# EAGLE schematic Optronik (EAGLE 7.5.0)

## Sheet 1 of 4: MCU_MAIN
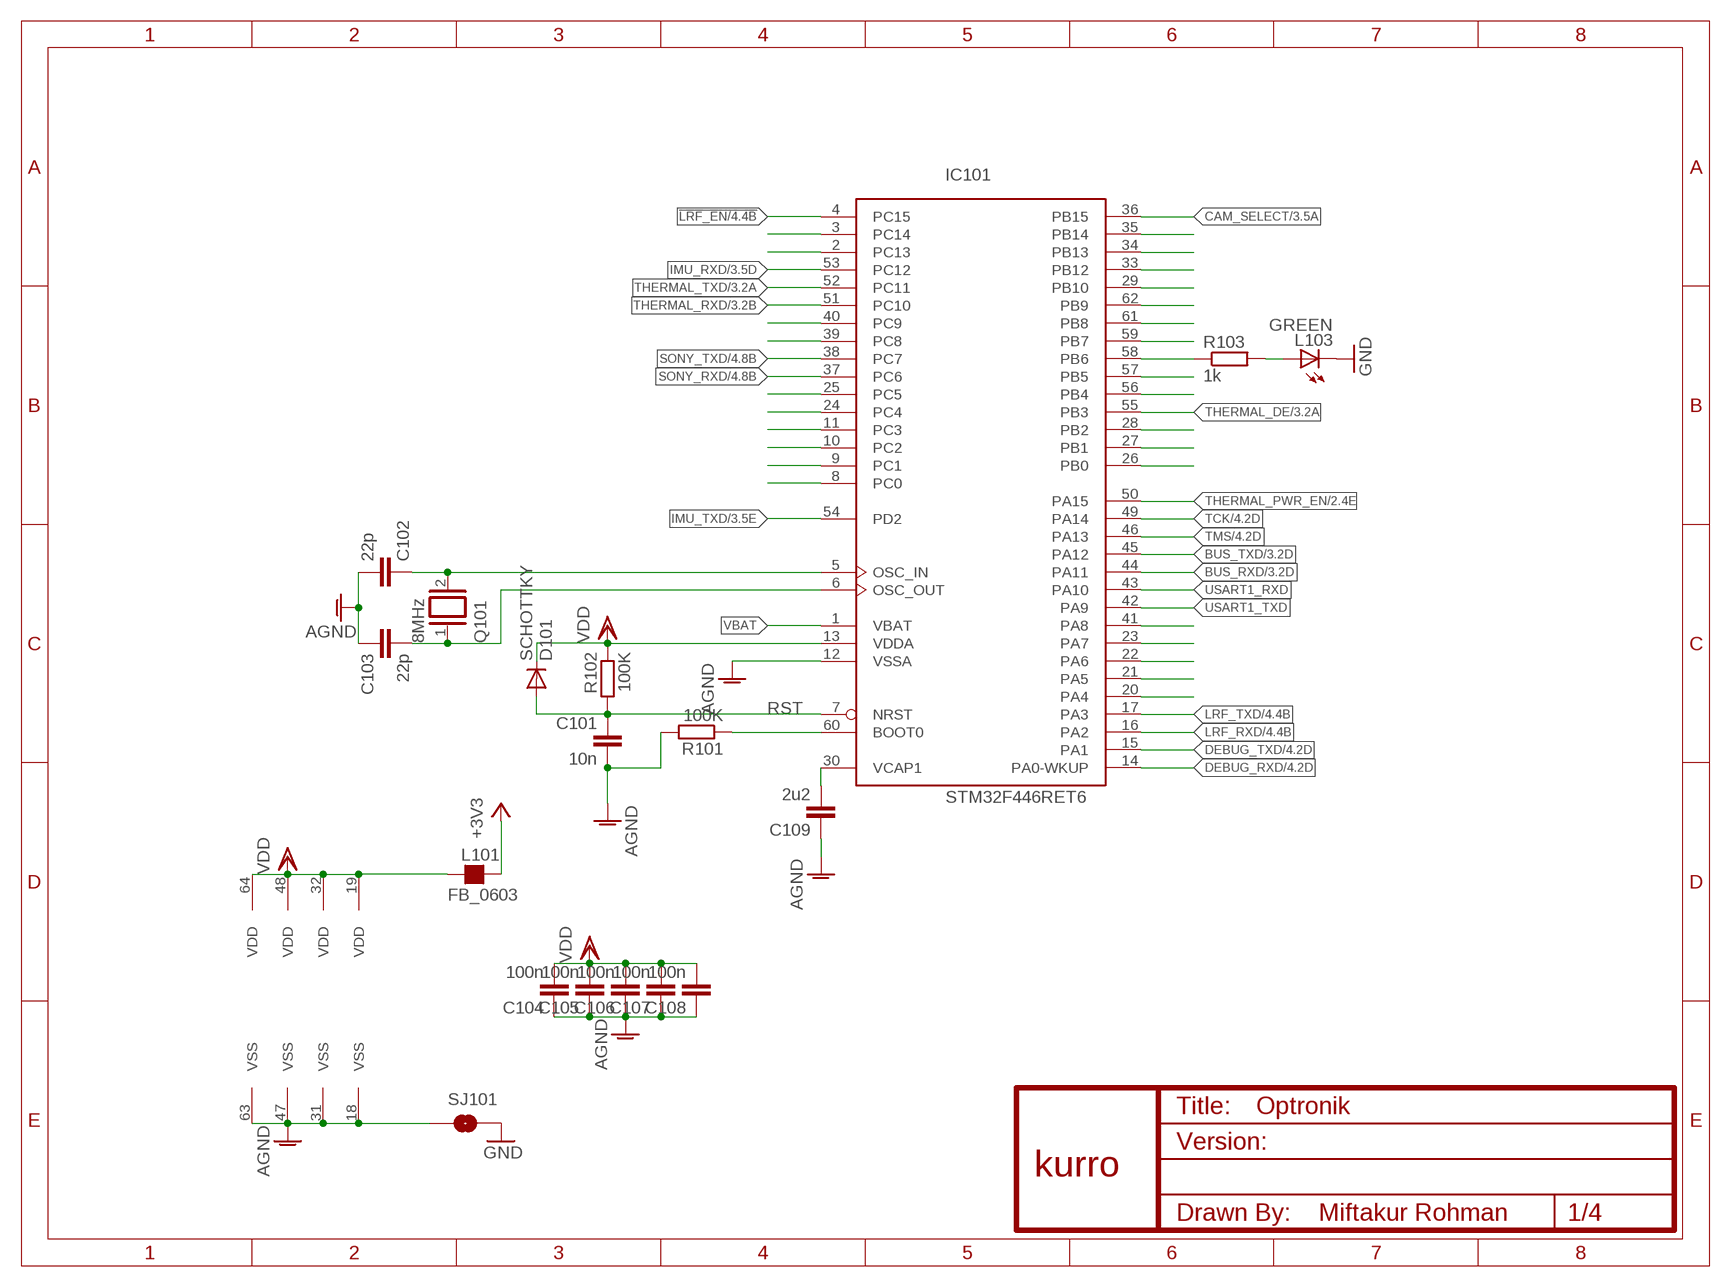
[diagram p0: schematic, sheet 1]

### Parts
C101  10n  C-EUC0603  [C0603]
C102  22p  C-EUC0603  [C0603]
C103  22p  C-EUC0603  [C0603]
C104  100n  C-EUC0603  [C0603]
C105  100n  C-EUC0603  [C0603]
C106  100n  C-EUC0603  [C0603]
C107  100n  C-EUC0603  [C0603]
C108  100n  C-EUC0603  [C0603]
C109  2u2  C-EUC0603  [C0603]
D101  SCHOTTKY  DIODE-MICROMELF-W  [MICROMELF-W]
IC101  STM32F446RET6  STM32F401RBT  [LQFP64]
L101  FB_0603  [L0603]
L103  GREEN  LEDCHIP-LED0805  [CHIP-LED0805]
Q101  8MHz  XTAL/S  [QS]
R101  100K  R-EU_R0603  [R0603]
R102  100K  R-EU_R0603  [R0603]
R103  1k  R-EU_R0603  [R0603]
SJ101  SOLDERJUMPERTRACE  [SJ_2S-TRACE]
U$1  KURRO_FOOTPRINT  [KURRO-LOGO]

### Nets
!LRF_EN [ic]: IC101.4(PC15) ; also sheet 4
+3V3: L101.2 ; also sheet 2,3,4
AGND [ic]: C101.2 C102.2 C103.1 C104.1 C105.1 C106.1 C107.1 C108.1 C109.1 IC101.12(VSSA) IC101.18(VSS) IC101.31(VSS) IC101.47(VSS) IC101.63(VSS) R101.2 SJ101.1
BOOT1 [ic]: IC101.60(BOOT0) R101.1
BUS_RXD [ic]: IC101.44(PA11) ; also sheet 3
BUS_TXD [ic]: IC101.45(PA12) ; also sheet 3
CAM_SELECT [ic]: IC101.36(PB15) ; also sheet 3
DEBUG_RXD [ic]: IC101.14(PA0-WKUP) ; also sheet 4
DEBUG_TXD [ic]: IC101.15(PA1) ; also sheet 4
GND: L103.C SJ101.2 ; also sheet 2,3,4
IMU_RXD [ic]: IC101.53(PC12) ; also sheet 3
IMU_TXD [ic]: IC101.54(PD2) ; also sheet 3
LED [ic]: IC101.58(PB6) R103.1
LRF_RXD [ic]: IC101.16(PA2) ; also sheet 4
LRF_TXD [ic]: IC101.17(PA3) ; also sheet 4
N$2 [ic]: C102.1 IC101.5(OSC_IN) Q101.2
N$4 [ic]: C109.2 IC101.30(VCAP1)
N$6 [ic]: IC101.22(PA6)
N$7 [ic]: IC101.3(PC14)
N$8 [ic]: IC101.2(PC13)
N$13 [ic]: IC101.40(PC9)
N$14 [ic]: IC101.39(PC8)
N$20 [ic]: IC101.41(PA8)
N$21 [ic]: IC101.62(PB9)
N$22 [ic]: L103.A R103.2
N$23 [ic]: IC101.21(PA5)
N$24 [ic]: C103.2 IC101.6(OSC_OUT) Q101.1
N$30 [ic]: IC101.23(PA7)
N$34 [ic]: IC101.20(PA4)
N$38 [ic]: IC101.26(PB0)
N$40 [ic]: IC101.27(PB1)
N$42 [ic]: IC101.28(PB2)
N$43 [ic]: IC101.29(PB10)
N$44 [ic]: IC101.33(PB12)
N$45 [ic]: IC101.34(PB13)
N$50 [ic]: IC101.25(PC5)
N$51 [ic]: IC101.35(PB14)
N$53 [ic]: IC101.24(PC4)
N$58 [ic]: IC101.11(PC3)
N$60 [ic]: IC101.10(PC2)
N$61 [ic]: IC101.9(PC1)
N$62 [ic]: IC101.8(PC0)
N$64 [ic]: IC101.61(PB8)
N$65 [ic]: IC101.59(PB7)
N$67 [ic]: IC101.57(PB5)
N$70 [ic]: IC101.56(PB4)
RST [ic]: C101.1 D101.A IC101.7(NRST) R102.2
SONY_RXD [ic]: IC101.37(PC6) ; also sheet 4
SONY_TXD [ic]: IC101.38(PC7) ; also sheet 4
TCK [ic]: IC101.49(PA14) ; also sheet 4
THERMAL_DE [ic]: IC101.55(PB3) ; also sheet 3
THERMAL_PWR_EN [ic]: IC101.50(PA15) ; also sheet 2
THERMAL_RXD [ic]: IC101.51(PC10) ; also sheet 3
THERMAL_TXD [ic]: IC101.52(PC11) ; also sheet 3
TMS [ic]: IC101.46(PA13) ; also sheet 4
USART1_RXD [ic]: IC101.43(PA10)
USART1_TXD [ic]: IC101.42(PA9)
VBAT [ic]: IC101.1(VBAT)
VDD [ic]: C104.2 C105.2 C106.2 C107.2 C108.2 D101.C IC101.13(VDDA) IC101.19(VDD) IC101.32(VDD) IC101.48(VDD) IC101.64(VDD) L101.1 R102.1 ; also sheet 4

## Sheet 2 of 4: PSU
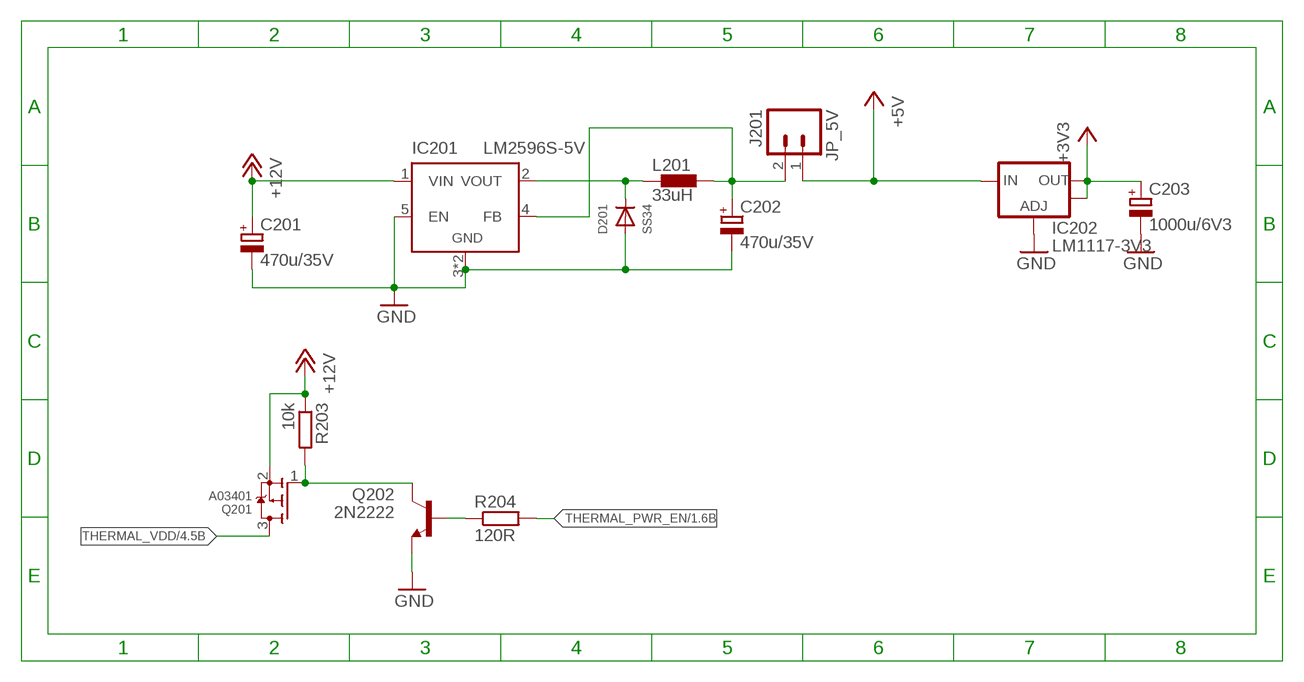
[diagram p1: schematic, sheet 2]

### Parts
C201  470u/35V  CPOL-EU153CLV-1012  [153CLV-1012]
C202  470u/35V  CPOL-EU153CLV-1012  [153CLV-1012]
C203  1000u/6V3  CPOL-EU153CLV-0810  [153CLV-0810]
D201  SS34  DIODESMA  [SMADIODE]
IC201  LM2596S-5V  LM2596S-ADJ  [D2PAK]
IC202  LM1117-3V3  V_REG_LM1117SOT223  [SOT223]
J201  JP_5V  M02-XH-VERT-SMD  [XH-2-VERT-SMD]
L201  33uH  PA4342  [PA4342]
Q201  A03401  A03401-WIDE  [SOT23-W]
Q202  2N2222  2N2222-REFLOW  [SOT23]
R203  10k  R-EU_R0603  [R0603]
R204  120R  R-EU_R0603  [R0603]

### Nets
+3V3: C203.+ IC202.2(OUT) IC202.4(OUT) ; also sheet 1,3,4
+5V: IC202.3(IN) J201.1 ; also sheet 3,4
+12V: C201.+ IC201.1(VIN) Q201.2(S) R203.1 ; also sheet 4
GND: C201.- C202.- C203.- D201.A IC201.3(GND) IC201.5(EN) IC201.6(GND) IC202.1(ADJ) Q202.2(E) ; also sheet 1,3,4
N$5: D201.C IC201.2(VOUT) L201.P$1
N$17: Q202.1(B) R204.1
N$29: C202.+ IC201.4(FB) J201.2 L201.P$2
N$39: Q201.1(G) Q202.3(C) R203.2
THERMAL_PWR_EN [ic]: R204.2 ; also sheet 1
THERMAL_VDD: Q201.3(D) ; also sheet 4

## Sheet 3 of 4
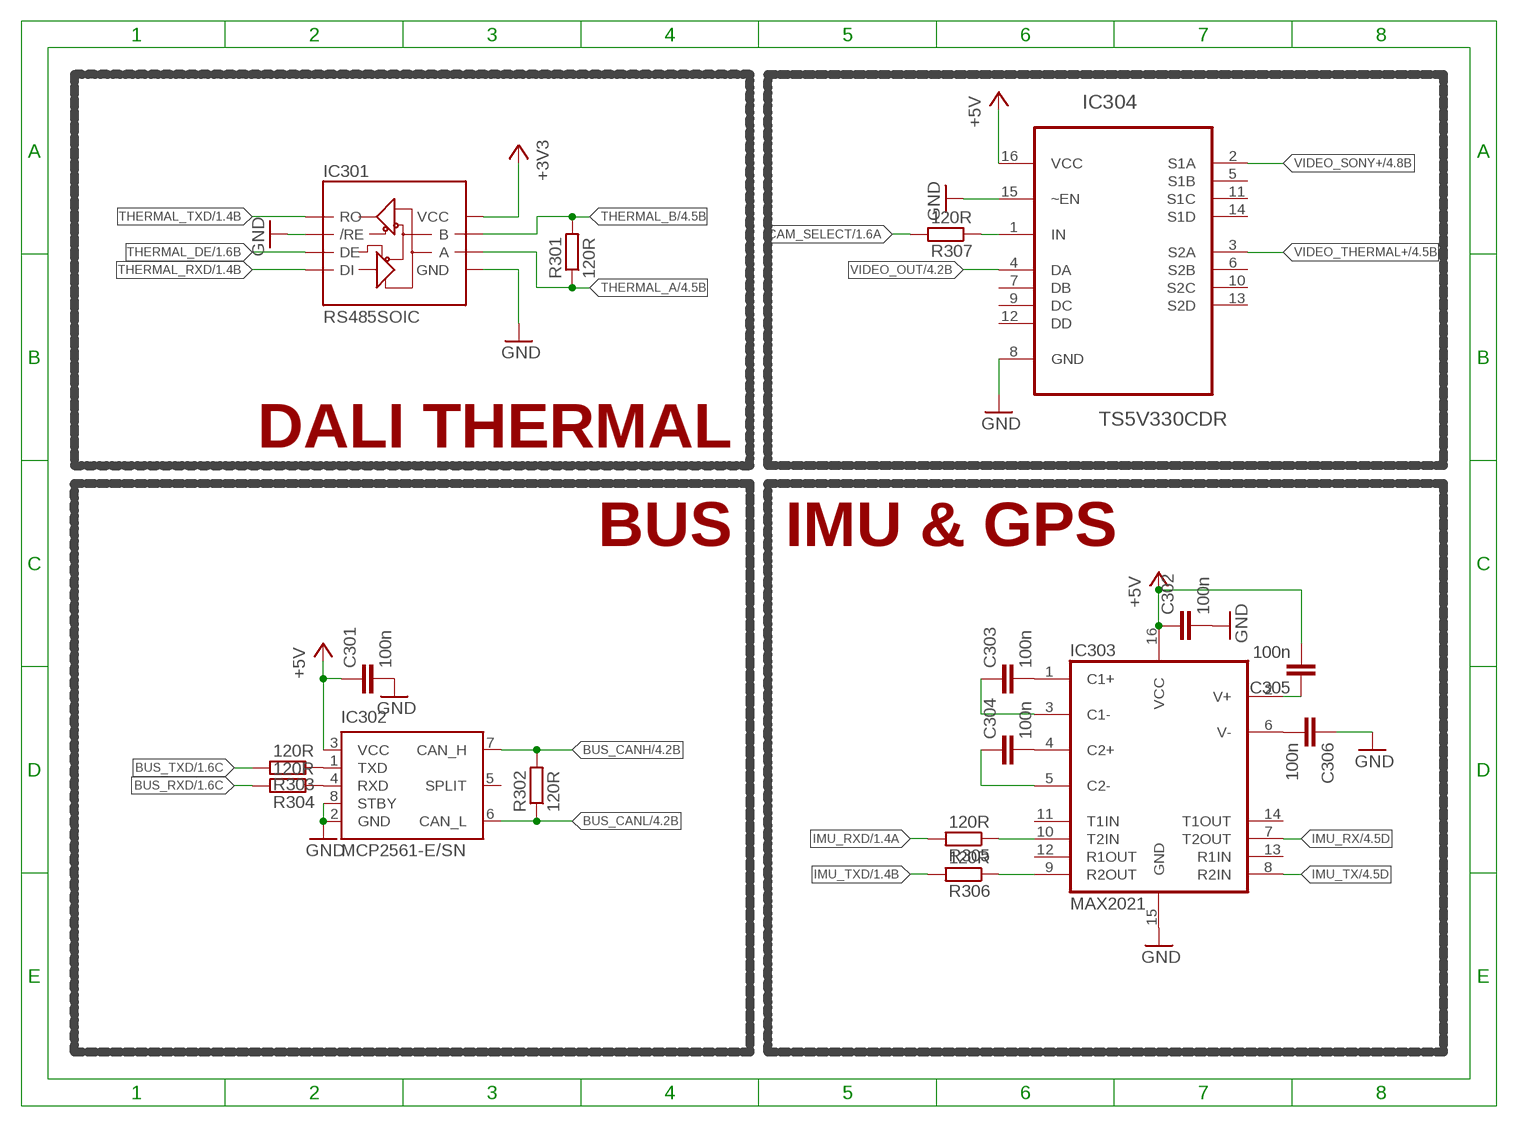
[diagram p2: schematic, sheet 3]

### Parts
C301  100n  C-EUC0603  [C0603]
C302  100n  C-EUC0603  [C0603]
C303  100n  C-EUC0603  [C0603]
C304  100n  C-EUC0603  [C0603]
C305  100n  C-EUC0603  [C0603]
C306  100n  C-EUC0603  [C0603]
IC301  RS485SOIC  [SO08]
IC302  MCP2561-E/SN  [SOIC-8]
IC303  MAX2021  MAX232SOIC16  [SO016]
IC304  TS5V330CDR  [SOIC127P600X175-16N]
R301  120R  R-EU_R0603  [R0603]
R302  120R  R-EU_R0603  [R0603]
R303  120R  R-EU_R0603  [R0603]
R304  120R  R-EU_R0603  [R0603]
R305  120R  R-EU_R0603  [R0603]
R306  120R  R-EU_R0603  [R0603]
R307  120R  R-EU_R0603  [R0603]

### Nets
+3V3: IC301.8(VCC) ; also sheet 1,2,4
+5V: C301.1 C302.1 C305.2 IC302.3(VCC) IC303.16(VCC) IC304.16(VCC) ; also sheet 2,4
BUS_CANH: IC302.7(CAN_H) R302.2 ; also sheet 4
BUS_CANL: IC302.6(CAN_L) R302.1 ; also sheet 4
BUS_RXD [ic]: R304.2 ; also sheet 1
BUS_TXD [ic]: R303.2 ; also sheet 1
CAM_SELECT [ic]: R307.2 ; also sheet 1
GND: C301.2 C302.2 C306.1 IC301.2(/RE) IC301.5(GND) IC302.2(GND) IC302.8(STBY) IC303.15(GND) IC304.8(GND) IC304.15(~EN) ; also sheet 1,2,4
IMU_RX: IC303.7(T2OUT) ; also sheet 4
IMU_RXD [ic]: R305.2 ; also sheet 1
IMU_TX: IC303.8(R2IN) ; also sheet 4
IMU_TXD [ic]: R306.2 ; also sheet 1
N$18: IC302.4(RXD) R304.1
N$31 [ic]: C306.2 IC303.6(V-)
N$32 [ic]: C303.2 IC303.1(C1+)
N$33 [ic]: C304.2 IC303.4(C2+)
N$49: IC302.1(TXD) R303.1
N$68: C303.1 IC303.3(C1-)
N$69: C304.1 IC303.5(C2-)
N$72: C305.1 IC303.2(V+)
N$73: IC304.1(IN) R307.1
N$74: IC303.10(T2IN) R305.1
N$75: IC303.9(R2OUT) R306.1
THERMAL_A: IC301.6(A) R301.1 ; also sheet 4
THERMAL_B: IC301.7(B) R301.2 ; also sheet 4
THERMAL_DE [ic]: IC301.3(DE) ; also sheet 1
THERMAL_RXD [ic]: IC301.4(DI) ; also sheet 1
THERMAL_TXD [ic]: IC301.1(RO) ; also sheet 1
VIDEO_OUT: IC304.4(DA) ; also sheet 4
VIDEO_SONY+: IC304.2(S1A) ; also sheet 4
VIDEO_THERMAL+: IC304.3(S2A) ; also sheet 4
Unconnected: IC302.5(SPLIT) IC303.11(T1IN) IC303.12(R1OUT) IC303.13(R1IN) IC303.14(T1OUT) IC304.5(S1B) IC304.6(S2B) IC304.7(DB) IC304.9(DC) IC304.10(S2C) IC304.11(S1C) IC304.12(DD) IC304.13(S2D) IC304.14(S1D)

### Notes on the sheet
- DALI THERMAL
- BUS | IMU & GPS

## Sheet 4 of 4: CONNECTOR
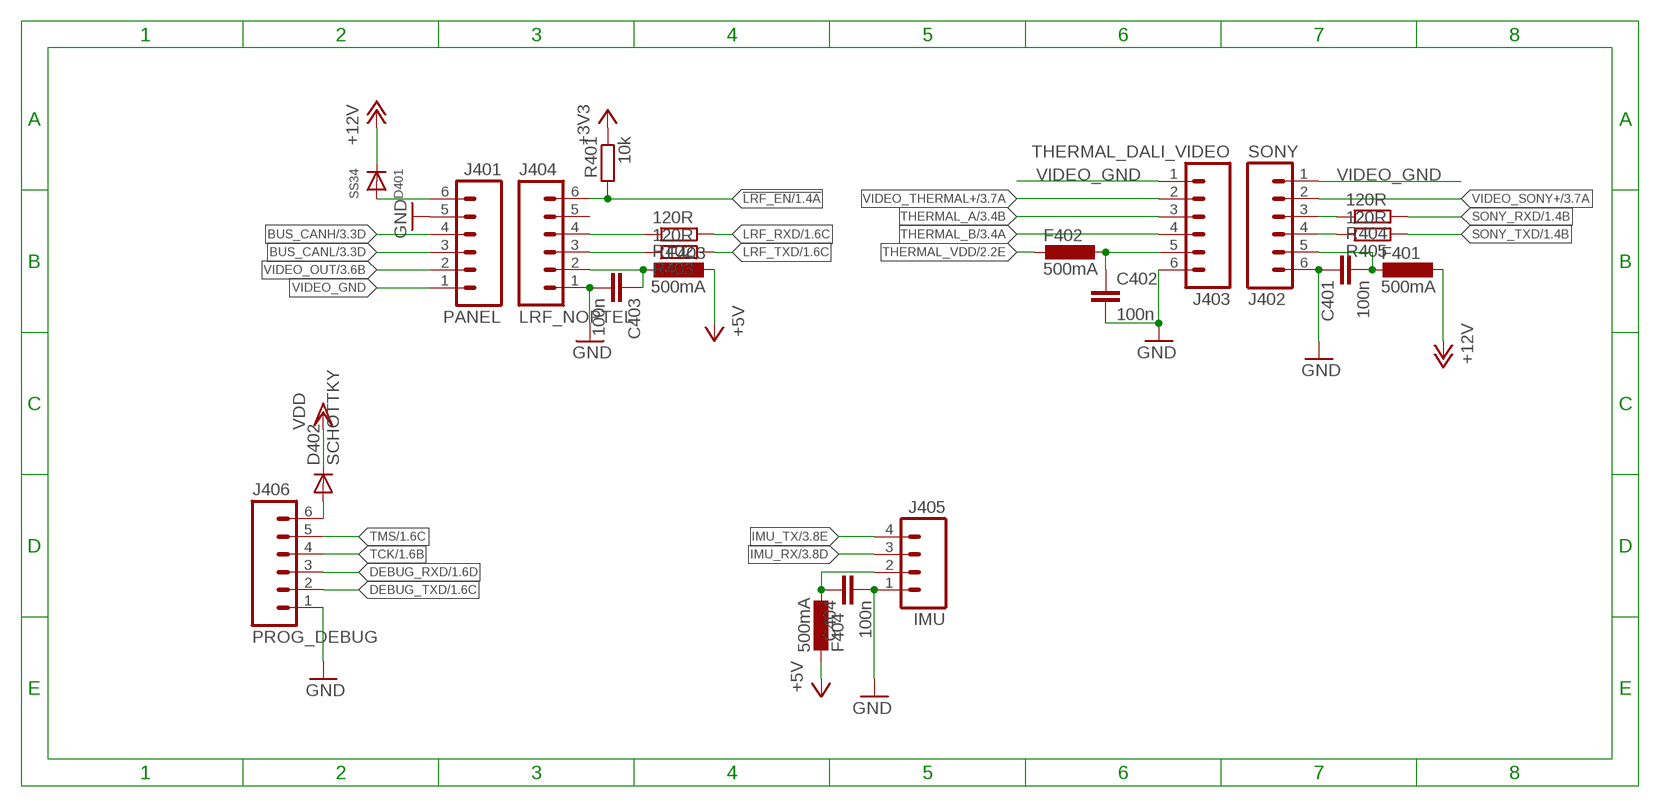
[diagram p3: schematic, sheet 4]

### Parts
C401  100n  C-EUC0603  [C0603]
C402  100n  C-EUC0603  [C0603]
C403  100n  C-EUC0603  [C0603]
C404  100n  C-EUC0603  [C0603]
D401  SS34  DIODESMA  [SMADIODE]
D402  SCHOTTKY  DIODE-MICROMELF-W  [MICROMELF-W]
F401  500mA  L-EUL0805  [L0805]
F402  500mA  L-EUL0805  [L0805]
F403  500mA  L-EUL0805  [L0805]
F404  500mA  L-EUL0805  [L0805]
J401  PANEL  M06-XH-RA  [XH-6-RA]
J402  SONY  M06-XH-RA  [XH-6-RA]
J403  THERMAL_DALI_VIDEO  M06-XH-RA  [XH-6-RA]
J404  LRF_NOPTEL  M06-XH-RA  [XH-6-RA]
J405  IMU  M04-XH-RA  [XH-4-RA]
J406  PROG_DEBUG  M06-XH-VERT  [XH-6-VERT]
R401  10k  R-EU_R0603  [R0603]
R402  120R  R-EU_R0603  [R0603]
R403  120R  R-EU_R0603  [R0603]
R404  120R  R-EU_R0603  [R0603]
R405  120R  R-EU_R0603  [R0603]

### Nets
!LRF_EN [ic]: J404.6 R401.2 ; also sheet 1
+3V3: R401.1 ; also sheet 1,2,3
+5V: F403.2 F404.2 ; also sheet 2,3
+12V: D401.C F401.1 ; also sheet 2
BUS_CANH: J401.4 ; also sheet 3
BUS_CANL: J401.3 ; also sheet 3
DEBUG_RXD [ic]: J406.3 ; also sheet 1
DEBUG_TXD [ic]: J406.2 ; also sheet 1
GND: C401.1 C402.2 C403.2 C404.2 J401.5 J402.6 J403.6 J404.1 J405.1 J406.1 ; also sheet 1,2,3
IMU_RX: J405.3 ; also sheet 3
IMU_TX: J405.4 ; also sheet 3
LRF_RXD [ic]: R402.2 ; also sheet 1
LRF_TXD [ic]: R403.2 ; also sheet 1
N$1: D402.A J406.6
N$3 [ic]: J402.3 R404.1
N$9 [ic]: J402.4 R405.1
N$12: D401.A J401.6
N$47: C402.1 F402.1 J403.5
N$48: C403.1 F403.1 J404.2
N$55: C404.1 F404.1 J405.2
N$56: J404.3 R403.1
N$59: J404.4 R402.1
SONY_RXD [ic]: R404.2 ; also sheet 1
SONY_TXD [ic]: R405.2 ; also sheet 1
SONY_VDD: C401.2 F401.2 J402.5
TCK [ic]: J406.4 ; also sheet 1
THERMAL_A: J403.3 ; also sheet 3
THERMAL_B: J403.4 ; also sheet 3
THERMAL_VDD: F402.2 ; also sheet 2
TMS [ic]: J406.5 ; also sheet 1
VDD [ic]: D402.C ; also sheet 1
VIDEO_GND: J401.1 J402.1 J403.1
VIDEO_OUT: J401.2 ; also sheet 3
VIDEO_SONY+: J402.2 ; also sheet 3
VIDEO_THERMAL+: J403.2 ; also sheet 3
Unconnected: J404.5

## Library data of the parts
C101-C109 C302-C306 C401-C404 = resistor:C-EU: CAPACITOR, European symbol
C201-C203 = resistor:CPOL-EU: POLARIZED CAPACITOR, European symbol
C301 = rcl:C-EU: CAPACITOR, European symbol
D101 D402 = diode:DIODE-: DIODE
D201 D401 = adafruit:DIODE: Diode SMADIODE - SMA Surface Mount Package 20V 1A Schottky Diode Digikey: 641-1014-6-ND DO-1N4148 - Through Hole Small Current Diode SOD-123 20V 1 A (.5mV Vf) Schottky Diode - Digikey: MBRX120TPMSCT-ND SOD-323 10V 570mA (.38mV Vf, 3ns) Schottky Diode - Digikey: ZLLS410CT-ND SOD-523 30V 30mA Schottky Diode (RB751S-40TE61) - Digikey: RB751S-40TE61CT-ND SOT23-R/W - SOT23 Package (R = Solder Paste/Reflow Ovens, W = Hand-Soldering) BAT54Film 40V 300mA - Digikey: 497-7162-1-ND
F401-F404 = rcl:L-EU: INDUCTOR, European symbol
IC101 = micro-stm_v3:STM32F401R*T: ARM 32-bit Cortex™-M3 CPU 84 MHz maximum frequency 128 to 256 Kbytes of Flash memory 64 kbytes of SRAM 50 GPIOs 1.7 to 3.6 V application supply
IC201 = ON Semiconductor_By_element14_Batch_1:LM2596S: STEP-DOWN VOLTAGE REGULATOR
IC202 = SparkFun:V_REG_LM1117: Voltage Regulator LM1117 Standard adjustable voltage regulator but in SMD form. Spark Fun Electronics SKU : COM-00595
IC301 = SparkFun-DigitalIC:RS485: RS485 transceiver
IC302 = microchip:MCP256*
IC303 = SparkFun-DigitalIC:MAX232: RS232 Transceiver Very common IC. This is generically called 'MAX232', but works with the 3V equivalent MAX3232 generic ICs. Field tested and mother approved. Spark Fun Electronics SKU : COM-00316 (DIP) and COM-00589 (SMD); PROD_ID: IC-08171
IC304 = Texas Instruments_By_element14_Batch_1:TS5V330CDR: QUAD SPDT WIDE BANDWIDTH VIDEO SWITCH WITH LOW ON-STATE RESISTANCE; MPN: TS5V330CDR; OC_FARNELL: -; OC_NEWARK: 09R6745; PACKAGE: SOIC-16; SUPPLIER: Texas Instruments
J201 = SparkFun-Connectors:M02: Standard 2-pin 0.1" header. Use with - straight break away headers ( PRT-00116) - right angle break away headers (PRT-00553) - swiss pins (PRT-00743) - machine pins (PRT-00117) - female headers (PRT-00115) Molex polarized connector foot print use with: PRT-08233 with associated crimp pins and housings. 2.54_SCREWTERM for use with PRT-10571. 3.5mm Screw Terminal footprints for PRT-08084 5mm Screw Terminal footprints for use with PRT-08433
J401-J404 J406 = SparkFun-Connectors:M06: Header 6 Standard 6-pin 0.1" header. Use with straight break away headers (SKU : PRT-00116), right angle break away headers (PRT-00553), swiss pins (PRT-00743), machine pins (PRT-00117), and female headers (PRT-00115). Molex polarized connector foot print use with SKU : PRT-08094 with associated crimp pins and housings. NOTES ON THE VARIANTS LOCK and LOCK_LONGPADS... This footprint was designed to help hold the alignment of a through-hole component (i.e. 6-pin header) while soldering it into place. You may notice that each hole has been shifted either up or down by 0.005 of an inch from it's more standard position (which is a perfectly straight line). This slight alteration caused the pins (the squares in the middle) to touch the edges of the holes. Because they are alternating, it causes a "brace" to hold the component in place. 0.005 has proven to be the perfect amount of "off-center" position when using our standard breakaway headers. Although looks a little odd when you look at the bare footprint, once you have a header in there, the alteration is very hard to notice. Also,if you push a header all the way into place, it is covered up entirely on the bottom side. This idea of altering the position of holes to aid alignment will be further integrated into the Sparkfun Library for other footprints. It can help hold any component with 3 or more connection pins.
J405 = SparkFun-Connectors:M04: Header 4 Standard 4-pin 0.1" header. Use with straight break away headers (SKU : PRT-00116), right angle break away headers (PRT-00553), swiss pins (PRT-00743), machine pins (PRT-00117), and female headers (PRT-00115). Molex polarized connector foot print use with SKU : PRT-08231 with associated crimp pins and housings. 1MM SMD Version SKU: PRT-10208
L101 = rc-master:FB_: FERRITE BEAD
L103 = led:LED: LED OSRAM: - CHIPLED LG R971, LG N971, LY N971, LG Q971, LY Q971, LO R971, LY R971 LH N974, LH R974 LS Q976, LO Q976, LY Q976 LO Q996 - Hyper CHIPLED LW Q18S LB Q993, LB Q99A, LB R99A - SideLED LS A670, LO A670, LY A670, LG A670, LP A670 LB A673, LV A673, LT A673, LW A673 LH A674 LY A675 LS A676, LA A676, LO A676, LY A676, LW A676 LS A679, LY A679, LG A679 - Hyper Micro SIDELED® LS Y876, LA Y876, LO Y876, LY Y876 LT Y87S - SmartLED LW L88C, LW L88S LB L89C, LB L89S, LG L890 LS L89K, LO L89K, LY L89K LS L896, LA L896, LO L896, LY L896 - TOPLED LS T670, LO T670, LY T670, LG T670, LP T670 LSG T670, LSP T670, LSY T670, LOP T670, LYG T670 LG T671, LOG T671, LSG T671 LB T673, LV T673, LT T673, LW T673 LH T674 LS T676, LA T676, LO T676, LY T676, LB T676, LH T676, LSB T676, LW T676 LB T67C, LV T67C, LT T67C, LS T67K, LO T67K, LY T67K, LW E67C LS E67B, LA E67B, LO E67B, LY E67B, LB E67C, LV E67C, LT E67C LW T67C LS T679, LY T679, LG T679 LS T770, LO T770, LY T770, LG T770, LP T770 LB T773, LV T773, LT T773, LW T773 LH T774 LS E675, LA E675, LY E675, LS T675 LS T776, LA T776, LO T776, LY T776, LB T776 LHGB T686 LT T68C, LB T68C - Hyper Mini TOPLED® LB M676 - Mini TOPLED Santana® LG M470 LS M47K, LO M47K, LY M47K Source: http://www.osram.convergy.de LUXEON: - LUMILED® LXK2-PW12-R00, LXK2-PW12-S00, LXK2-PW14-U00, LXK2-PW14-V00 LXK2-PM12-R00, LXK2-PM12-S00, LXK2-PM14-U00 LXK2-PE12-Q00, LXK2-PE12-R00, LXK2-PE12-S00, LXK2-PE14-T00, LXK2-PE14-U00 LXK2-PB12-K00, LXK2-PB12-L00, LXK2-PB12-M00, LXK2-PB14-N00, LXK2-PB14-P00, LXK2-PB14-Q00 LXK2-PR12-L00, LXK2-PR12-M00, LXK2-PR14-Q00, LXK2-PR14-R00 LXK2-PD12-Q00, LXK2-PD12-R00, LXK2-PD12-S00 LXK2-PH12-R00, LXK2-PH12-S00 LXK2-PL12-P00, LXK2-PL12-Q00, LXK2-PL12-R00 Source: www.luxeon.com KINGBRIGHT: KA-3528ASYC Source: www.kingbright.com
L201 = scorpion:PA4342
Q101 = special:XTAL/S: CRYSTAL
Q201 = scorpion:A03401*: 30V P-Channel MOSFET Feature: VDS: -30V ID (at VGS=10V): -4A RDS(ON) (at VGS=10V): <50mOhm RDS(ON) (at VGS = 4.5V): <60mOhm RDS(ON) (at VGS = 2.5V): <85mOhm datasheet <http://www.aosmd.com/pdfs/datasheet/AO3401.pdf> tokopedia <https://www.tokopedia.com/tokopuwei/mosfet-ao3401-fet-ao3401-sot23-p-channel-30v-4a-a19t-sot-23-az37>
Q202 = scorpion:2N2222*
R101-R103 R203 R204 R401-R405 = resistor:R-EU_: RESISTOR, European symbol
R301 R303-R307 = rcl:R-EU_: RESISTOR, European symbol
R302 = rcl:R-EU_: RESISTOR, European symbol; DNP: T
SJ101 = SparkFun:SOLDERJUMPER: Solder Jumper Standard SMD solder jumper. Used to automate production. Two varients : Normally Open and Normally Closed are the same, but have different paste layers. NC will have a large amount of paste and should jumper during reflow.; BOM: EXCLUDE; DNP: T
U$1 = SparkFun:KURRO_FOOTPRINT

## Net classes
0 default: width 0.406 mm, drill 0.59 mm, clearance 0.305 mm
1 ic: width 0.203 mm, drill 0.59 mm, clearance 0.203 mm
2 power: width 0.406 mm, drill 0.79 mm, clearance 0.406 mm